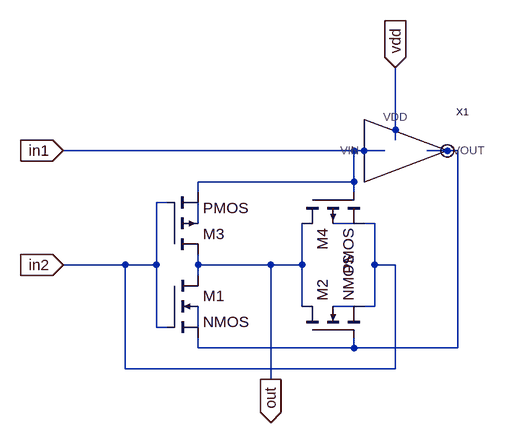
[diagram p0: schematic xor.asc]
xor.asc, the LTspice schematic file:
Version 4
SHEET 1 880 680
WIRE 432 80 432 -32
WIRE 368 96 -80 96
WIRE 416 96 368 96
WIRE 528 96 480 96
WIRE 368 144 368 96
WIRE 368 144 128 144
WIRE 128 160 128 144
WIRE 368 160 368 144
WIRE 80 176 64 176
WIRE 128 208 128 176
WIRE 368 208 336 208
WIRE 400 208 384 208
WIRE 16 272 -80 272
WIRE 64 272 64 176
WIRE 64 272 16 272
WIRE 128 272 128 256
WIRE 240 272 128 272
WIRE 288 272 288 208
WIRE 288 272 240 272
WIRE 400 272 400 208
WIRE 432 272 400 272
WIRE 128 288 128 272
WIRE 288 336 288 272
WIRE 368 336 336 336
WIRE 400 336 400 272
WIRE 400 336 384 336
WIRE 64 368 64 272
WIRE 80 368 64 368
WIRE 128 368 128 336
WIRE 128 400 128 384
WIRE 368 400 368 384
WIRE 368 400 128 400
WIRE 528 400 528 96
WIRE 528 400 368 400
WIRE 16 432 16 272
WIRE 432 432 432 272
WIRE 432 432 16 432
WIRE 240 448 240 272
FLAG -80 272 in2
IOPIN -80 272 In
FLAG -80 96 in1
IOPIN -80 96 In
FLAG 432 -32 vdd
IOPIN 432 -32 In
FLAG 240 448 out
IOPIN 240 448 Out
SYMBOL inverter 432 96 R0
SYMATTR InstName X1
SYMBOL nmos4 80 288 R0
SYMATTR InstName M1
SYMBOL nmos4 288 384 R270
SYMATTR InstName M2
SYMBOL pmos4 80 256 M180
SYMATTR InstName M3
SYMBOL pmos4 288 160 M90
SYMATTR InstName M4

The netlist it stands for:
* xor.asc
XX1 vdd N001 in1 inverter  ; pins VDD VOUT VIN
M1 out in2 N001 N005 NMOS
M2 out N001 in2 N004 NMOS
M3 out in2 in1 N002 PMOS
M4 out in1 in2 N003 PMOS
.model NMOS NMOS
.model PMOS PMOS
.lib standard.mos
.backanno
.end